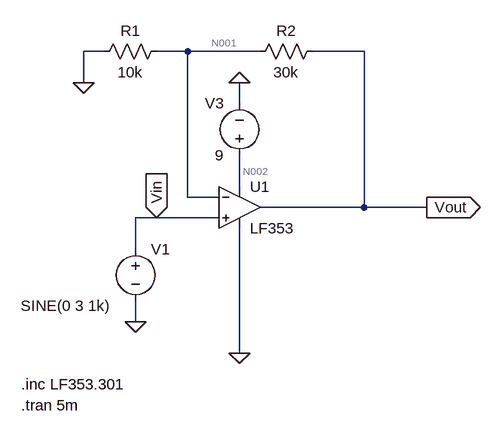
[diagram p0: schematic LF353 9v.asc]
LF353 9v.asc, the LTspice schematic file:
Version 4.1
SHEET 1 880 680
WIRE 0 16 -32 16
WIRE 128 16 80 16
WIRE 240 16 128 16
WIRE 400 16 320 16
WIRE -32 64 -32 16
WIRE 208 96 208 64
WIRE 208 224 208 176
WIRE 128 240 128 16
WIRE 176 240 128 240
WIRE 400 256 400 16
WIRE 400 256 240 256
WIRE 496 256 400 256
WIRE 80 272 48 272
WIRE 176 272 80 272
WIRE 48 320 48 272
WIRE 48 432 48 400
WIRE 208 480 208 288
FLAG 208 64 0
FLAG 208 480 0
FLAG 496 256 Vout
IOPIN 496 256 Out
FLAG 48 432 0
FLAG -32 64 0
FLAG 80 272 Vin
IOPIN 80 272 In
SYMBOL res 96 0 R90
WINDOW 0 0 56 VBottom 2
WINDOW 3 32 56 VTop 2
SYMATTR InstName R1
SYMATTR Value 10k
SYMBOL res 336 0 R90
WINDOW 0 0 56 VBottom 2
WINDOW 3 32 56 VTop 2
SYMATTR InstName R2
SYMATTR Value 30k
SYMBOL voltage 48 304 R0
WINDOW 3 -177 103 Left 2
WINDOW 123 0 0 Left 0
WINDOW 39 0 0 Left 0
SYMATTR Value SINE(0 3 1k)
SYMATTR InstName V1
SYMBOL OpAmps\\opamp2 208 192 R0
SYMATTR InstName U1
SYMATTR Value LF353
SYMBOL voltage 208 192 R180
WINDOW 0 24 96 Left 2
WINDOW 3 24 16 Left 2
WINDOW 123 0 0 Left 0
WINDOW 39 0 0 Left 0
SYMATTR InstName V3
SYMATTR Value 9
TEXT -128 560 Left 2 !.tran 5m
TEXT -128 528 Left 2 !.inc LF353.301

The netlist it stands for:
* LF353 9v.asc
R1 N001 0 10k
R2 Vout N001 30k
V1 Vin 0 SINE(0 3 1k)
X§U1 Vin N001 N002 0 Vout LF353  ; pins In+ In- V+ V- OUT
V3 N002 0 9
.tran 5m
.inc LF353.301
.backanno
.end

* Results of the author's LTspice run, read from the files saved beside the schematic
* Operating Point, zero values left out:
*   V(n001) = 400.6 mV
*   V(n002) = 9 V
*   V(vout) = 1.603 V
*   I(R1) = 40.06 µA
*   I(R2) = 40.06 µA
*   I(V1) = 51.96 µA
*   I(V3) = -795 µA
*   Ix(u1:1) = -51.96 µA
*   Ix(u1:2) = 15.49 pA
*   Ix(u1:3) = 795 µA
*   Ix(u1:4) = -738.4 µA
*   Ix(u1:5) = -40.06 µA
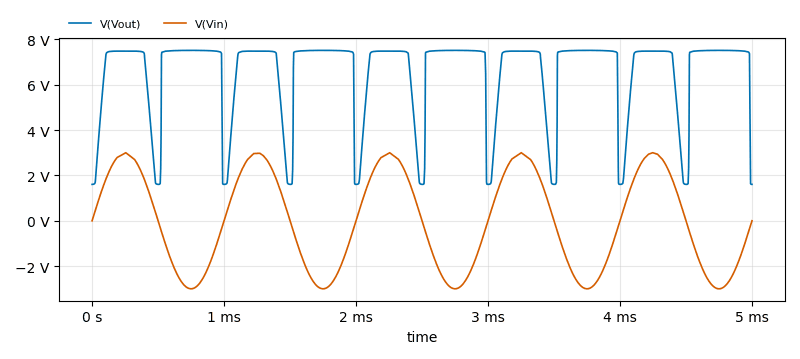
[diagram p1: Transient Analysis of LF353 9v.asc, plotted from the saved traces]
* Transient Analysis, 1 run:
*   V(Vout): min 1.603 V, max 7.51 V, average 6.519 V, rms 6.801 V, last 1.603 V
*   V(Vin): min -3 V, max 3 V, average -4.569 mV, rms 2.118 V, last 0 V